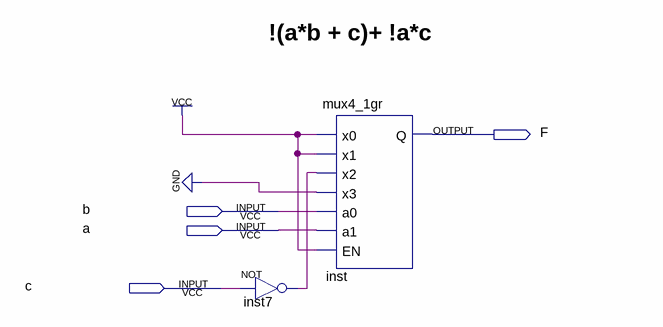
[diagram p0: schematic sheet]
// Quartus schematic log3.bdf as structural Verilog: 2 symbols, 4 pins
module log3 (
  input  b,
  input  a,
  input  c,
  output F
);

  wire inst7_out;

  not inst7 (inst7_out, c);
  mux4_1gr inst (.x0(1'b1), .x1(1'b1), .x2(inst7_out), .x3(1'b0), .a0(b), .a1(a), .EN(1'b1), .Q(F));

  // Notes on the sheet:
  //   !(a*b + c)+ !a*c
endmodule
